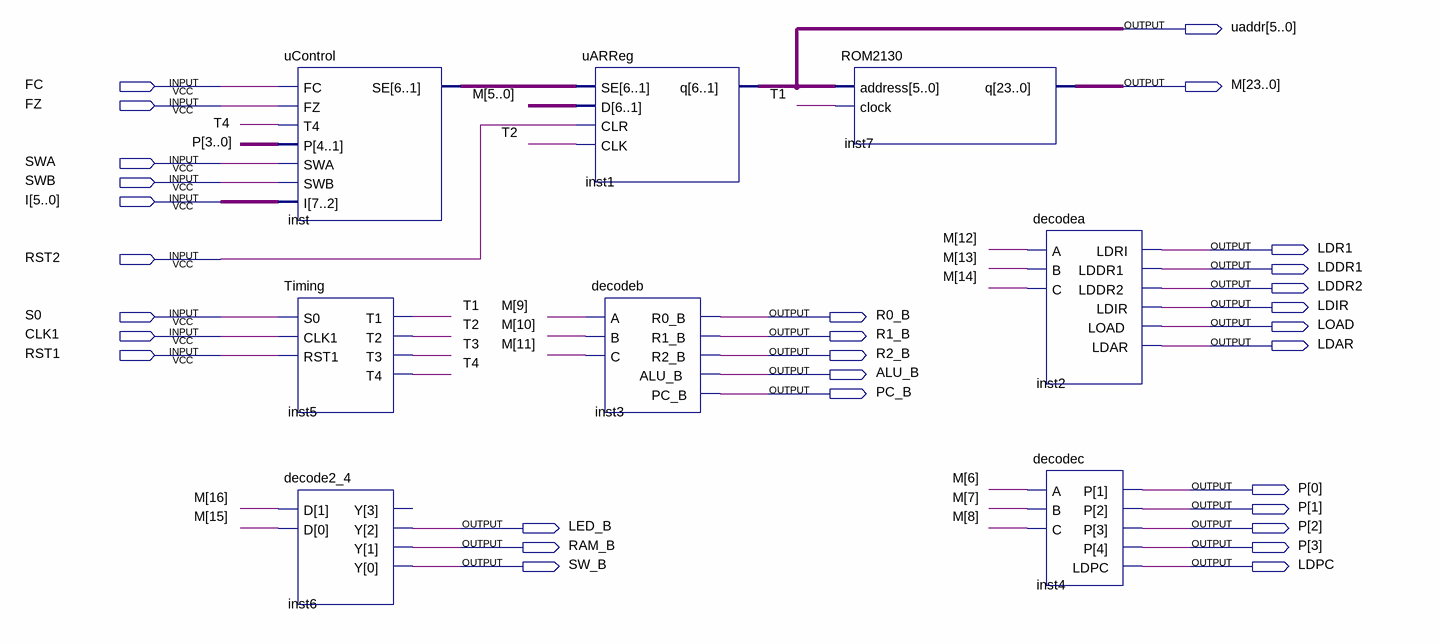
[diagram p0: schematic sheet]
// Quartus schematic uControl2130.bdf as structural Verilog: 8 symbols, 30 pins
module uControl2130 (
  input  FC,
  input  FZ,
  input  SWA,
  input  SWB,
  input  [5:0] I,
  input  RST2,
  input  S0,
  input  CLK1,
  input  RST1,
  output [5:0] uaddr,
  output [23:0] M,
  output LDR1,
  output LDDR1,
  output LDDR2,
  output LDIR,
  output R0_B,
  output LOAD,
  output R1_B,
  output LDAR,
  output R2_B,
  output ALU_B,
  output PC_B,
  output [3:0] P,
  output LED_B,
  output RAM_B,
  output SW_B,
  output LDPC
);

  wire T1, T2, T3, T4;
  wire [5:0] inst_se;
  wire [3:0] inst6_y_open;  // unused outputs

  uControl inst (.FC(FC), .FZ(FZ), .T4(T4), .P(P), .SWA(SWA), .SWB(SWB), .I(I), .SE(inst_se));
  Timing inst5 (.S0(S0), .CLK1(CLK1), .RST1(RST1), .T1(T1), .T2(T2), .T3(T3), .T4(T4));
  decode2_4 inst6 (.D(M[16:15]), .Y({inst6_y_open[3], LED_B, RAM_B, SW_B}));
  uARReg inst1 (.SE(inst_se), .D(M[5:0]), .CLR(RST2), .CLK(T2), .q(uaddr));
  decodeb inst3 (.A(M[9]), .B(M[10]), .C(M[11]), .R0_B(R0_B), .R1_B(R1_B), .R2_B(R2_B), .ALU_B(ALU_B), .PC_B(PC_B));
  ROM2130 inst7 (.address(uaddr), .clock(T1), .q(M));
  decodea inst2 (
    .A(M[12]), .B(M[13]), .C(M[14]), .LDRI(LDR1), .LDDR1(LDDR1), .LDDR2(LDDR2), .LDIR(LDIR), .LOAD(LOAD),
    .LDAR(LDAR));
  decodec inst4 (.A(M[6]), .B(M[7]), .C(M[8]), .P(P), .LDPC(LDPC));
endmodule
